# EAGLE design pc (EAGLE 7.1.0)
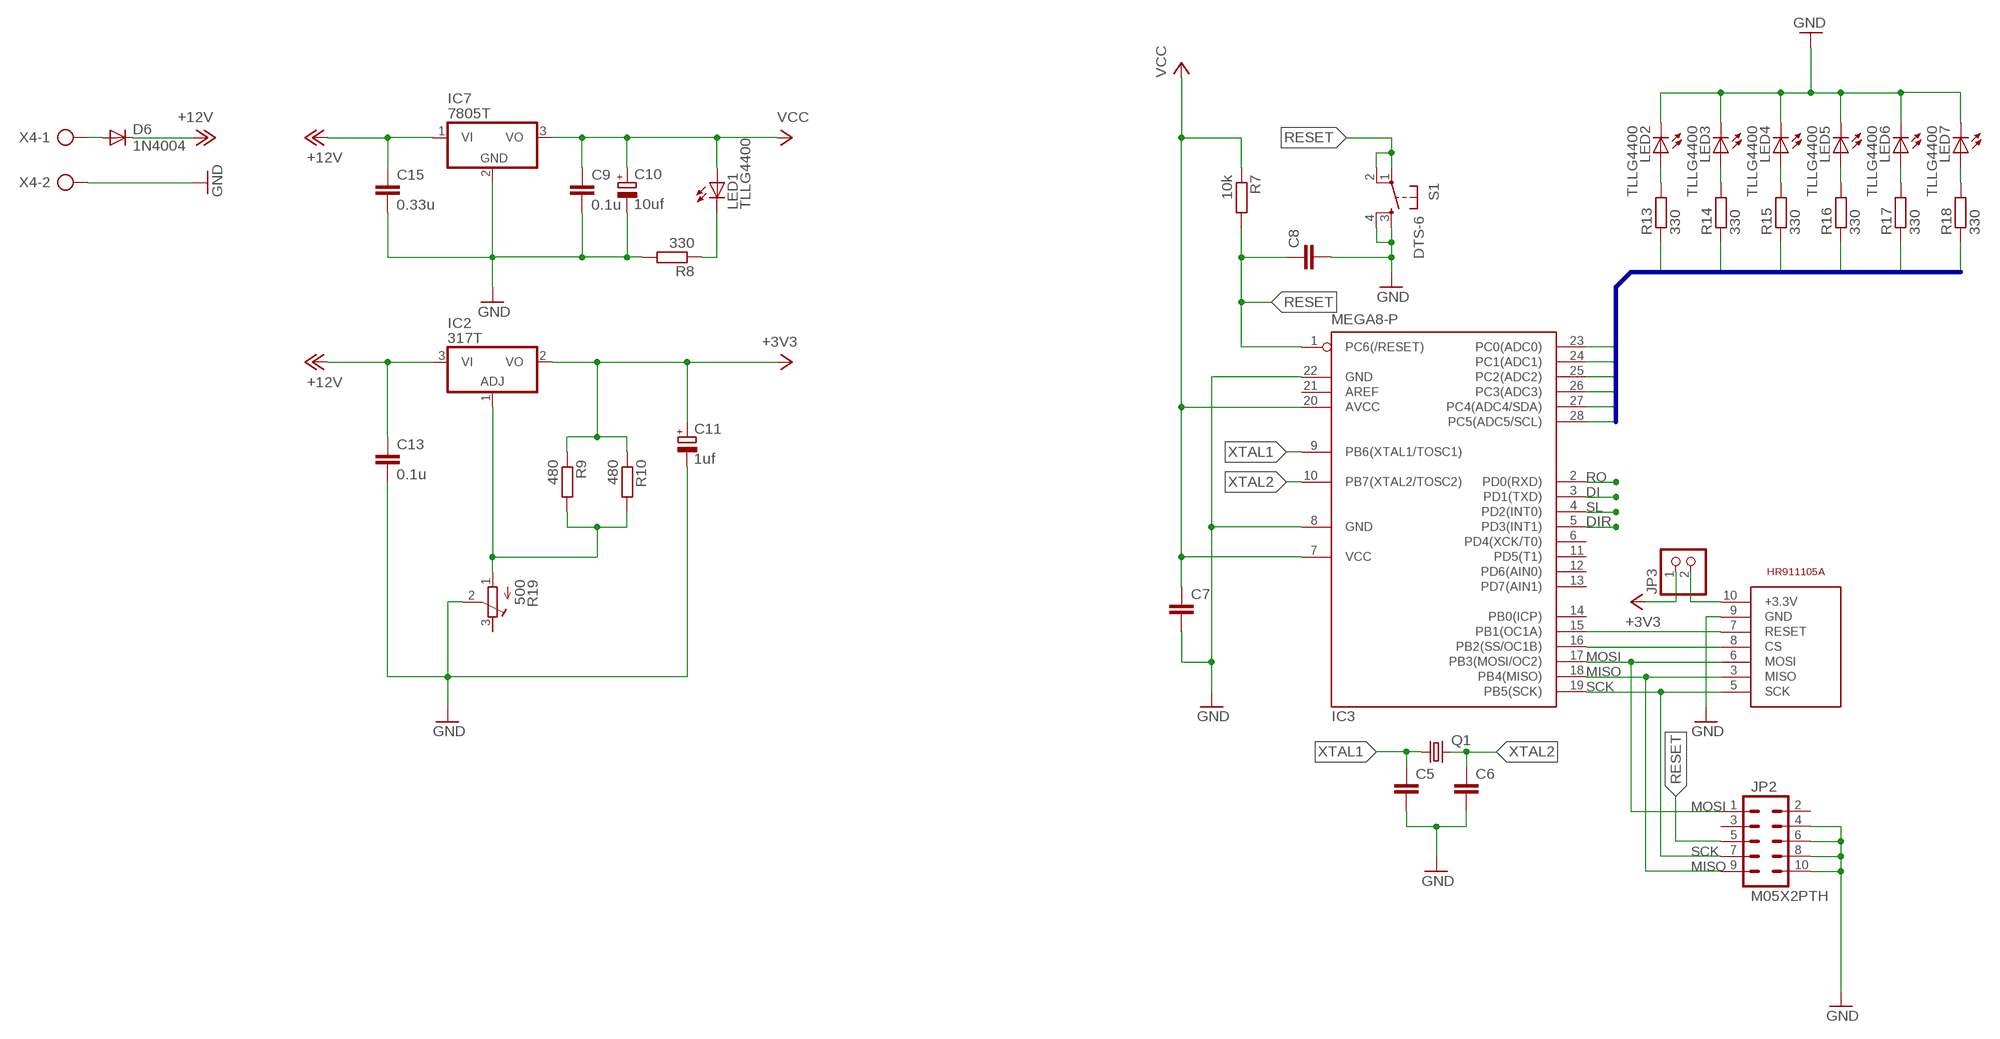
[diagram p0: schematic, sheet 1, part 1 of 2]
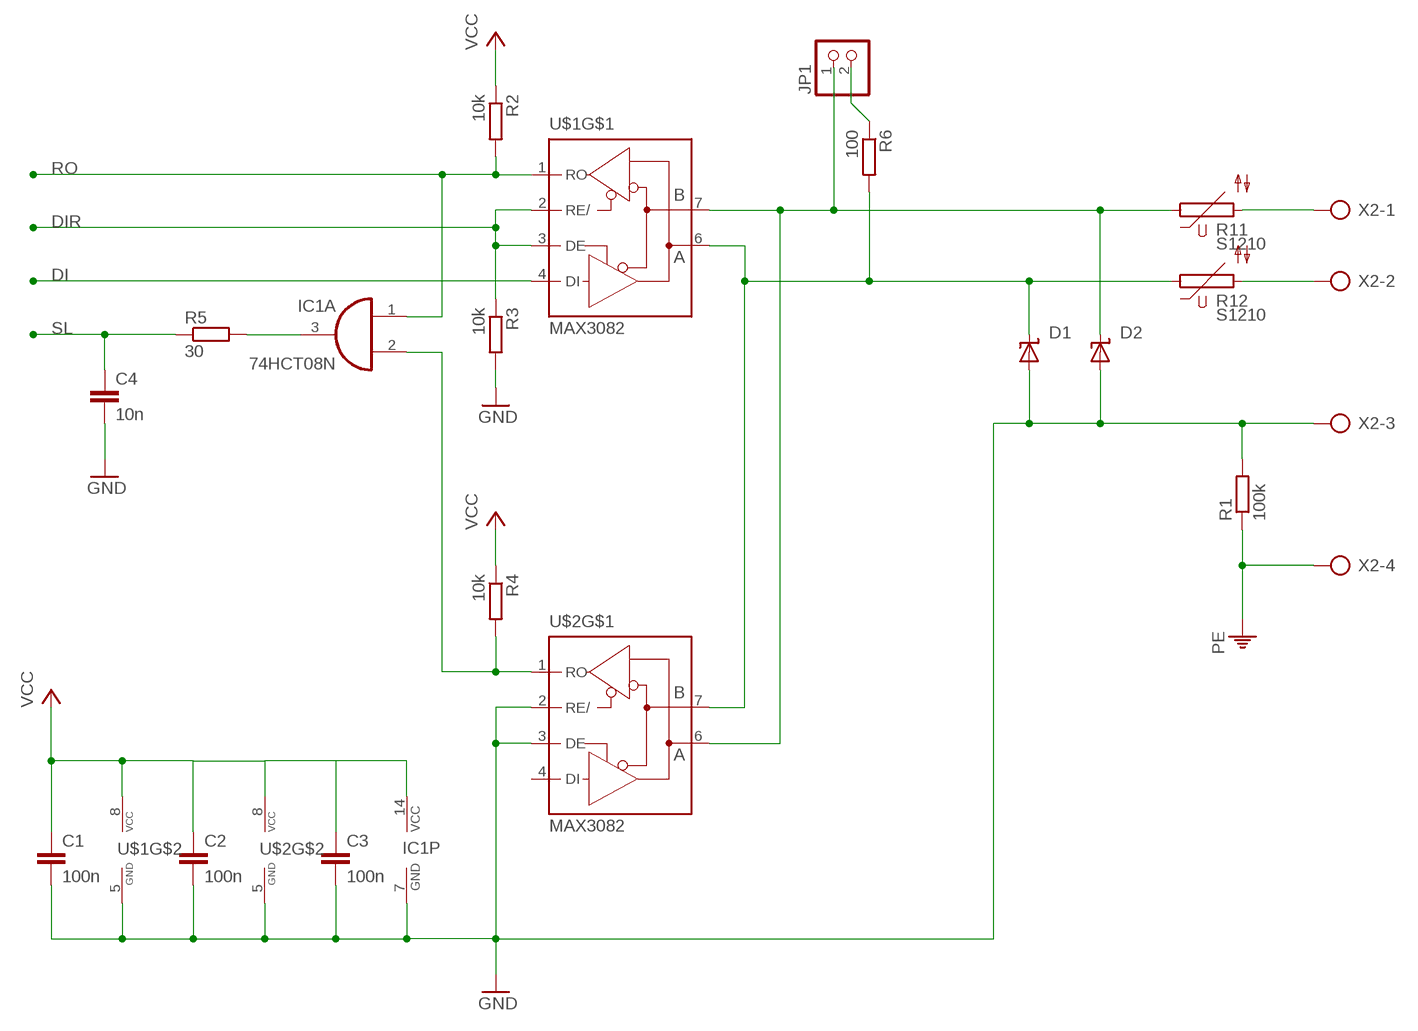
[diagram p1: schematic, sheet 1, part 2 of 2]

## Parts
C1  100n  C-EU050-035X075  [C050-035X075]
C2  100n  C-EU050-035X075  [C050-035X075]
C3  100n  C-EU050-035X075  [C050-035X075]
C4  10n  C-EU050-035X075  [C050-035X075]
C5  C-EU050-024X044  [C050-024X044]
C6  C-EU050-024X044  [C050-024X044]
C7  C-EU050-025X075  [C050-025X075]
C8  C-EU050-025X075  [C050-025X075]
C9  0.1u  C-EU025-024X044  [C025-024X044]
C10  10uf  CPOL-EUE2-4  [E2-4]
C11  1uf  CPOL-EUE2-4  [E2-4]
C13  0.1u  C-EU025-024X044  [C025-024X044]
C15  0.33u  C-EU025-024X044  [C025-024X044]
D1  SUPPRESSOR-SMBJ  [SMBJ]
D2  SUPPRESSOR-SMBJ  [SMBJ]
D6  1N4004  [DO41-10]
IC1  74HCT08N  [DIL14]
IC2  317T  [TO220H]
IC3  MEGA8-P  [DIL28-3]
IC7  7805T  [TO220H]
JP1  PINHD-1X2  [1X02]
JP2  M05X2PTH  [AVR_ICSP]
JP3  PINHD-1X2  [1X02]
LED1  TLLG4400  [LED3MM]
LED2  TLLG4400  [LED3MM]
LED3  TLLG4400  [LED3MM]
LED4  TLLG4400  [LED3MM]
LED5  TLLG4400  [LED3MM]
LED6  TLLG4400  [LED3MM]
LED7  TLLG4400  [LED3MM]
Q1  CRYSTALHC49U70  [HC49U70]
R1  100k  R-EU_0204/7  [0204/7]
R2  10k  R-EU_0204/7  [0204/7]
R3  10k  R-EU_0204/7  [0204/7]
R4  10k  R-EU_0204/7  [0204/7]
R5  30  R-EU_0207/10  [0207/10]
R6  100  R-EU_0204/7  [0204/7]
R7  10k  R-EU_0204/7  [0204/7]
R8  330  R-EU_0204/7  [0204/7]
R9  480  R-EU_0204/7  [0204/7]
R10  480  R-EU_0204/7  [0204/7]
R11  S1210  [S1210]
R12  S1210  [S1210]
R13  330  R-EU_0204/7  [0204/7]
R14  330  R-EU_0204/7  [0204/7]
R15  330  R-EU_0204/7  [0204/7]
R16  330  R-EU_0204/7  [0204/7]
R17  330  R-EU_0204/7  [0204/7]
R18  330  R-EU_0204/7  [0204/7]
R19  500  R-TRIMM64W  [RTRIM64W]
S1  DTS-6  [DTS-6]
U$1  MAX3082  [DIL08]
U$2  MAX3082  [DIL08]
U$3  HR911105A  [HR911105A]
X2  AK500/4  [AK500/4]
X4  AK500/2-H  [AK500/2-H]

## Nets
+3V3: C11.+ IC2.2(VO) JP3.1 R9.1 R10.1
+12V: C13.1 C15.1 D6.C IC2.3(VI) IC7.1(VI)
DI: IC3.3(PD1(TXD)) U$1.4(DI)
DIR: IC3.5(PD3(INT1)) R3.1 U$1.2(RE/) U$1.3(DE)
GND: C1.2 C2.2 C3.2 C4.2 C5.2 C6.2 C7.2 C8.2 C9.2 C10.- C11.- C13.2 C15.2 D1.A D2.A IC1.7(P:GND) IC3.8(GND) IC3.22(GND) IC7.2(GND) JP2.4 JP2.6 JP2.8 JP2.10 LED2.K(C) LED3.K(C) LED4.K(C) LED5.K(C) LED6.K(C) LED7.K(C) R1.2 R3.2 R8.2 R19.2(S) S1.3 S1.4 U$1.5(GND) U$2.2(RE/) U$2.3(DE) U$2.5(GND) U$3.9(GND) X2.3 X4.2
LED0: IC3.23(PC0(ADC0)) R13.1
LED1: IC3.24(PC1(ADC1)) R14.1
LED2: IC3.25(PC2(ADC2)) R15.1
LED3: IC3.26(PC3(ADC3)) R16.1
LED4: IC3.27(PC4(ADC4/SDA)) R17.1
LED5: IC3.28(PC5(ADC5/SCL)) R18.1
MISO: IC3.18(PB4(MISO)) JP2.9 U$3.3(MISO)
MOSI: IC3.17(PB3(MOSI/OC2)) JP2.1 U$3.6(MOSI)
N$1: IC2.1(ADJ) R9.2 R10.2 R19.1(A)
N$2: D1.C R6.2 R12.1 U$1.6(A) U$2.7(B)
N$3: IC1.2(A:I1) R4.2 U$2.1(RO)
N$4: LED1.K(C) R8.1
N$5: IC3.16(PB2(SS/OC1B)) U$3.8(CS)
N$6: LED2.A R13.2
N$7: IC1.3(A:O) R5.2
N$8: JP1.2 R6.1
N$9: R11.2 X2.1
N$10: D2.C JP1.1 R11.1 U$1.7(B) U$2.6(A)
N$11: R12.2 X2.2
N$12: LED3.A R14.2
N$13: LED4.A R15.2
N$14: LED5.A R16.2
N$15: LED6.A R17.2
N$16: LED7.A R18.2
N$17: IC3.15(PB1(OC1A)) U$3.7(RESET)
N$18: JP3.2 U$3.10(+3.3V)
N$19: D6.A X4.1
PE: R1.1 X2.4
RESET: C8.1 IC3.1(PC6(/RESET)) JP2.5 R7.2 S1.1 S1.2
RO: IC1.1(A:I0) IC3.2(PD0(RXD)) R2.2 U$1.1(RO)
SCK: IC3.19(PB5(SCK)) JP2.7 U$3.5(SCK)
SL: C4.1 IC3.4(PD2(INT0)) R5.1
VCC: C1.1 C2.1 C3.1 C7.1 C9.1 C10.+ IC1.14(P:VCC) IC3.7(VCC) IC3.20(AVCC) IC7.3(VO) LED1.A R2.1 R4.1 R7.1 U$1.8(VCC) U$2.8(VCC)
XTAL1: C5.1 IC3.9(PB6(XTAL1/TOSC1)) Q1.1
XTAL2: C6.1 IC3.10(PB7(XTAL2/TOSC2)) Q1.2
Unconnected: IC1.4(B:I0) IC1.5(B:I1) IC1.6(B:O) IC1.8(C:O) IC1.9(C:I0) IC1.10(C:I1) IC1.11(D:O) IC1.12(D:I0) IC1.13(D:I1) IC3.6(PD4(XCK/T0)) IC3.11(PD5(T1)) IC3.12(PD6(AIN0)) IC3.13(PD7(AIN1)) IC3.14(PB0(ICP)) IC3.21(AREF) JP2.2 JP2.3 R19.3(E) U$2.4(DI)

## Buses
LED[0..5]

## Library data of the parts
C1-C9 C13 C15 = rcl:C-EU: CAPACITOR, European symbol
C10 C11 = rcl:CPOL-EU: POLARIZED CAPACITOR, European symbol
D1 D2 = diode:SUPPRESSOR-: Suppressor diode
D6 = diode:1N4004: DIODE general purpose rectifier, 1 A
IC1 = 74xx-eu:74*08: Quad 2-input AND gate
IC2 = linear:*317: Positive VOLTAGE REGULATOR
IC3 = atmel:MEGA8-P: MICROCONTROLLER 8 Kbytes FLASH, 1 kbytes SRAM, 512 bytes EEPROM, USART, 4-channel 10 bit ADC, 2-channel 8 bit ADC Pin compatible with Atmega48, ATMega88, ATMega168 Source: avr.lbr; OC_FARNELL: unknown; OC_NEWARK: unknown
IC7 = linear:78*: Positive VOLTAGE REGULATOR Source: http://cache.national.com/ds/LM/LM78L05.pdf http://www.fairchildsemi.com/ds/LM/LM7805.pdf
JP1 JP3 = pinhead:PINHD-1X2: PIN HEADER
JP2 = SparkFun:M05X2: Header 5x2 Standard 10-pin dual row 0.1" header. Commonly used with AVR-ISP. Use with Spark Fun Electronics SKU: PRT-00778
LED1-LED7 = led:TLLG4400: Low Current (2mA) LED 3 mm Tinted Diffused Package color GREEN Source: Data sheet <http://www.farnell.com/datasheets/391098.pdf>; MF: VISHAY SEMICONDUCTOR; OC_FARNELL: 1612435
Q1 = crystal:CRYSTAL: CRYSTAL; OC_FARNELL: unknown; OC_NEWARK: unknown
R1-R4 R6 = resistor:R-EU_: RESISTOR, European symbol
R5 R7-R10 R13-R18 = rcl:R-EU_: RESISTOR, European symbol
R11 R12 = varistor:S1210: VARISTOR
R19 = rcl:R-TRIMM: Trimm resistor
S1 = switch-tact:DTS-6
U$1 U$2 = maxim:MAX3082
U$3 = ethernet:HR911105A
X2 = con-ptr500:AK500/4: CONNECTOR; OC_FARNELL: unknown; OC_NEWARK: unknown
X4 = con-ptr500:AK500/2-H: CONNECTOR Aug. 2004 / PTR Meßtechnik: Die Bezeichnung der Serie AK505 wurde geändert. Es handelt sich hierbei um AK500 in horizontaler Ausführung.; OC_FARNELL: unknown; OC_NEWARK: unknown

## Board
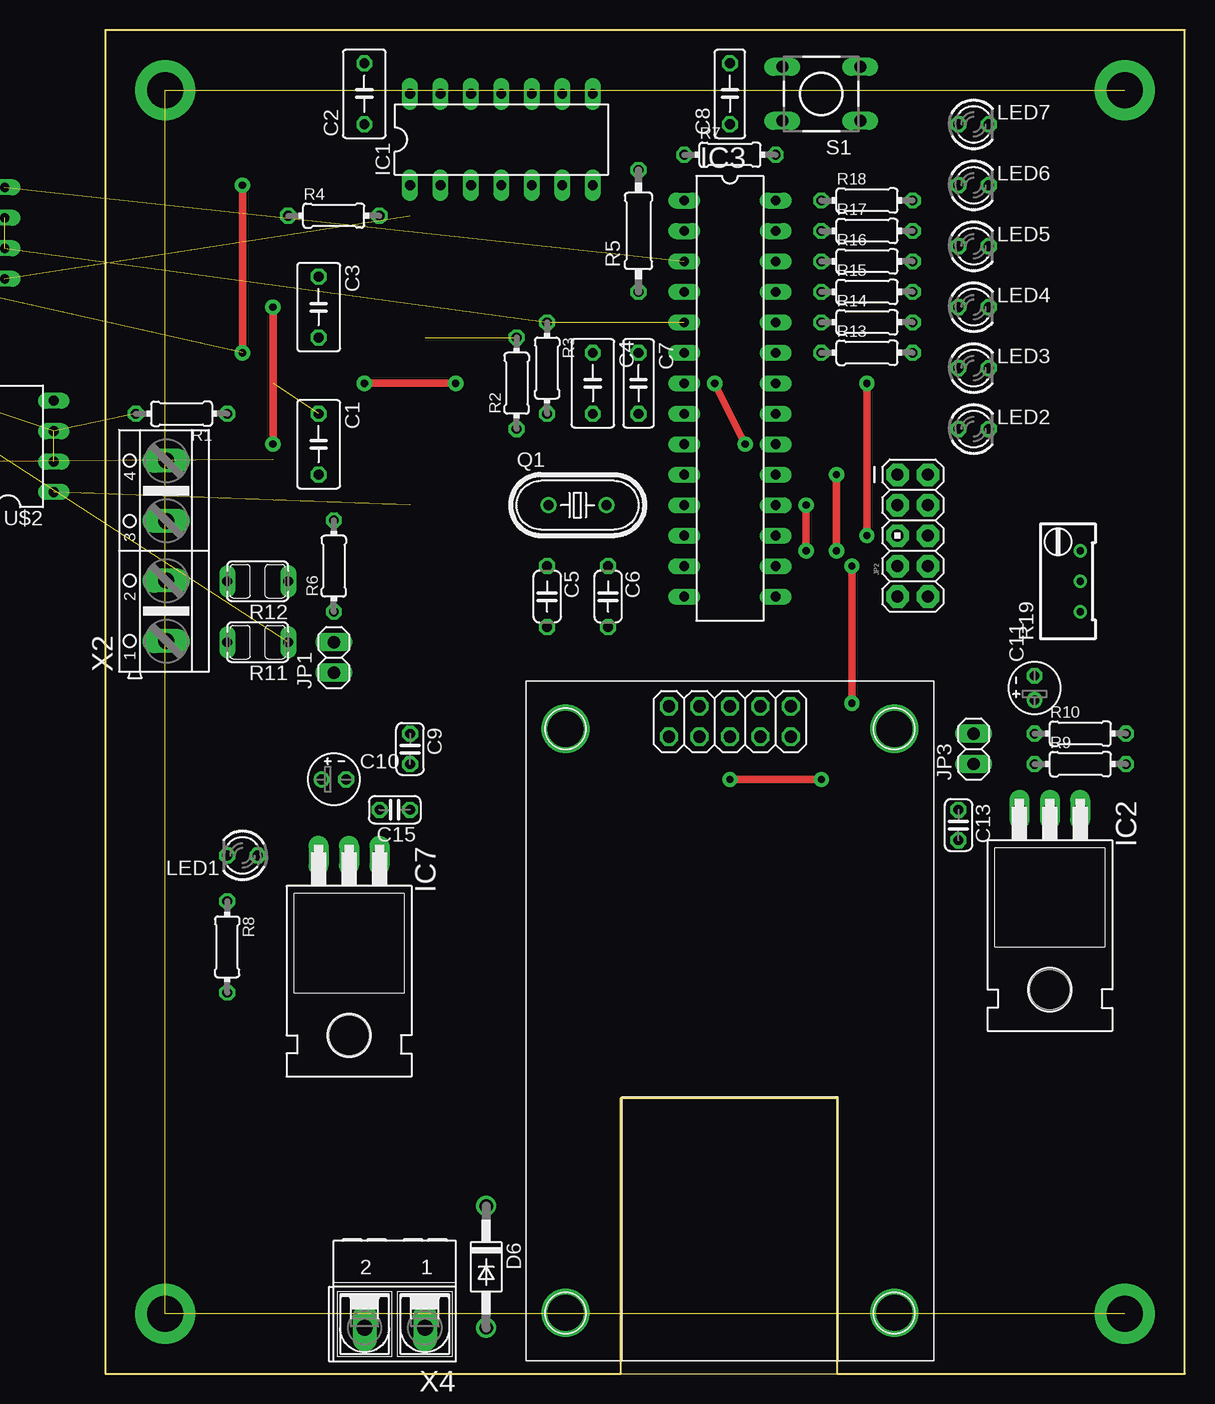
[diagram p2: board, top side]
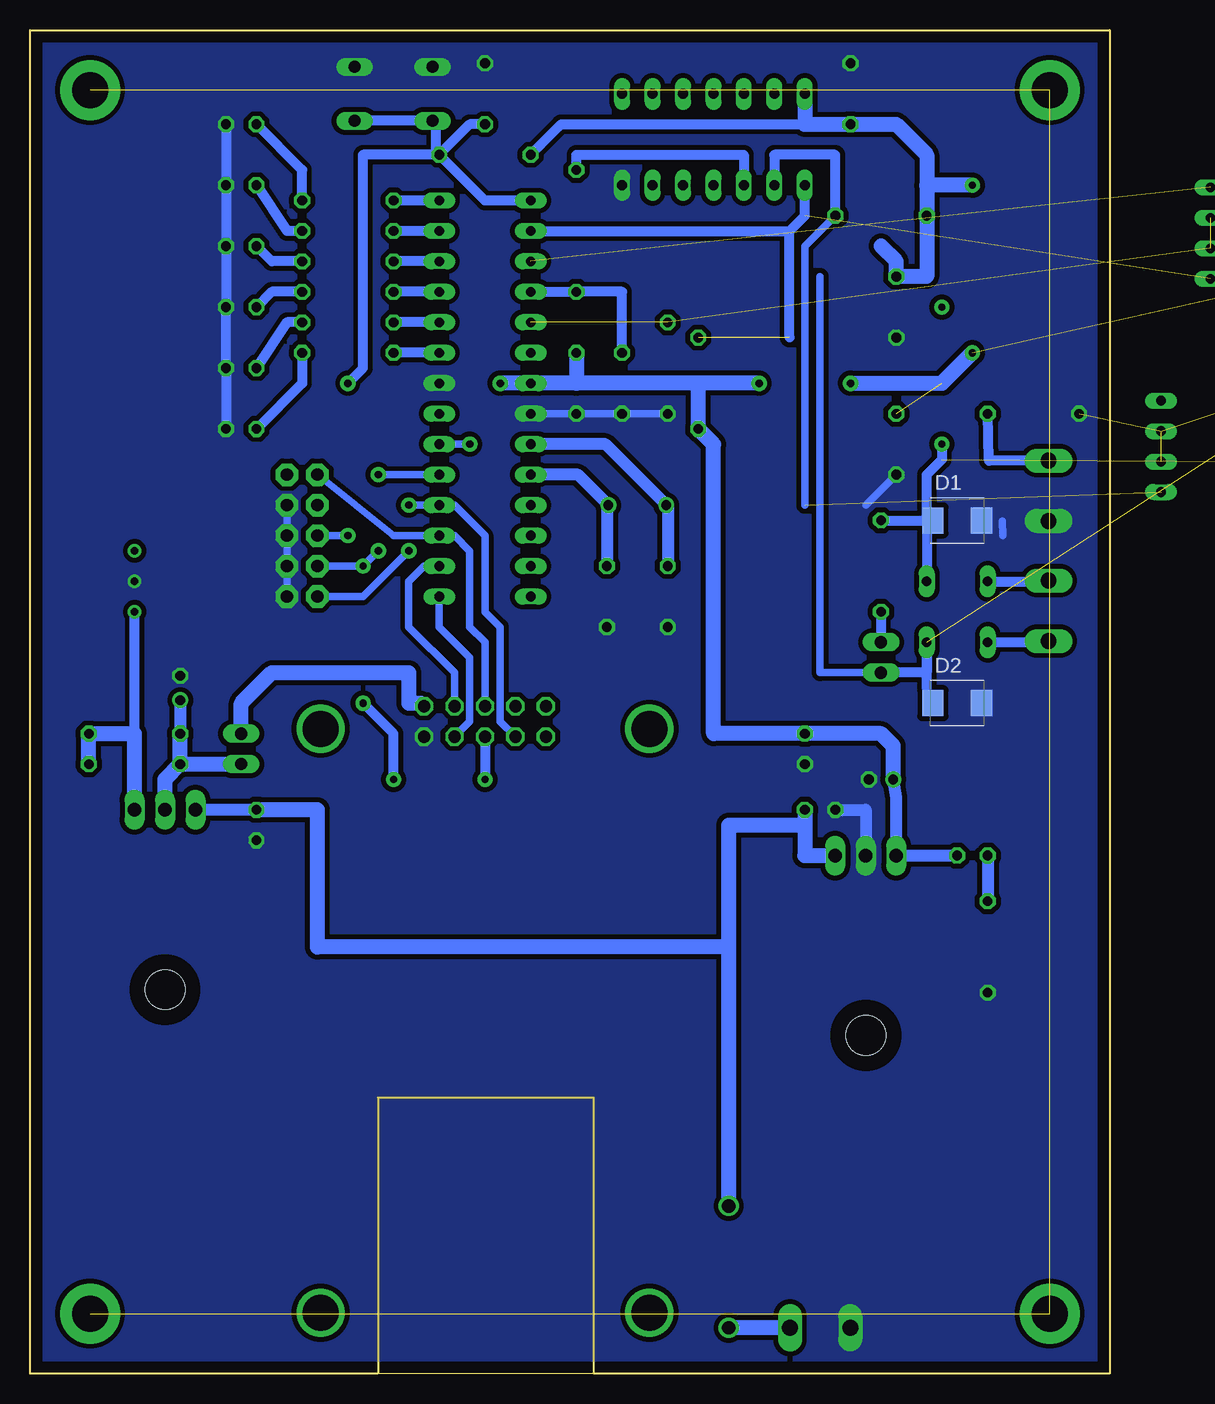
[diagram p3: board, bottom side, seen from below]

Size 90 x 112 mm. Coordinates in mm from the lower left corner, seen from the top.
Outline: 0,0 90,0 90,112 0,112 0,0
Copper layers (1*16): Top 0.035mm / dielectric 1.5mm / Bottom 0.035mm
Design rules "default": minimum track width 10mil, minimum drill 24mil, track to track 8mil, track to pad 8mil, pad to pad 8mil, via to via 8mil, smd to smd 8mil, copper to edge 40mil, drill to drill 8mil, minimum pad ring 10mil, minimum via ring 8mil, stop-mask expansion 4mil, vias tented up to drill 0mil, thermal gap 10mil
Milling: 8 lines

### Footprints (pad centres in the part's own frame; a part is rotated, then mirrored left to right if it is on the bottom)
C050-035X075 = drill 0.813 octagon: 1 -2.54,0; 2 2.54,0
C050-024X044 = drill 0.813 octagon: 1 -2.54,0; 2 2.54,0
C050-025X075 = drill 0.813 octagon: 1 -2.54,0; 2 2.54,0
C025-024X044 = drill 0.813 octagon: 1 -1.27,0; 2 1.27,0
E2-4 = drill 0.813 pad 1.27: + -1.016,0 | drill 0.813 pad 1.27 octagon: - 1.016,0
SMBJ = smd 1.78 x 2.16: A 2.04,0; C -2.03,0
DO41-10 = drill 1.118: A 5.08,0; C -5.08,0
DIL14 = drill 0.813 long: 1 -7.62,-3.81; 2 -5.08,-3.81; 3 -2.54,-3.81; 4 0,-3.81; 5 2.54,-3.81; 6 5.08,-3.81; 7 7.62,-3.81; 8 7.62,3.81; 9 5.08,3.81; 10 2.54,3.81; 11 0,3.81; 12 -2.54,3.81; 13 -5.08,3.81; 14 -7.62,3.81
TO220H = drill 1.118 long: 1 -2.54,-10.16; 2 0,-10.16; 3 2.54,-10.16 | hole 3.302: 0,4.826
DIL28-3 = drill 0.813 long: 1 -16.51,-3.81; 2 -13.97,-3.81; 3 -11.43,-3.81; 4 -8.89,-3.81; 5 -6.35,-3.81; 6 -3.81,-3.81; 7 -1.27,-3.81; 8 1.27,-3.81; 9 3.81,-3.81; 10 6.35,-3.81; 11 8.89,-3.81; 12 11.43,-3.81; 13 13.97,-3.81; 14 16.51,-3.81; 15 16.51,3.81; 16 13.97,3.81; 17 11.43,3.81; 18 8.89,3.81; 19 6.35,3.81; 20 3.81,3.81; 21 1.27,3.81; 22 -1.27,3.81; 23 -3.81,3.81; 24 -6.35,3.81; 25 -8.89,3.81; 26 -11.43,3.81; 27 -13.97,3.81; 28 -16.51,3.81
1X02 = drill 1.016 long: 1 -1.27,0; 2 1.27,0
AVR_ICSP = drill 1.016 pad 1.88 octagon: 1 -1.27,5.08; 2 1.27,5.08; 3 -1.27,2.54; 4 1.27,2.54; 5 -1.27,0; 6 1.27,0; 7 -1.27,-2.54; 8 1.27,-2.54; 9 -1.27,-5.08; 10 1.27,-5.08
LED3MM = drill 0.813 octagon: A -1.27,0; K 1.27,0
HC49U70 = drill 0.813: 1 -2.413,0; 2 2.413,0
0204/7 = drill 0.813 octagon: 1 -3.81,0; 2 3.81,0
0207/10 = drill 0.813 octagon: 1 -5.08,0; 2 5.08,0
S1210 = drill 0.813 long: 1 -2.54,0; 2 2.54,0
RTRIM64W = drill 0.61: 1 1.27,-2.54; 2 1.27,0; 3 1.27,2.54
DTS-6 = drill 1 long: 1 -3.25,2.25; 2 3.25,2.25; 3 -3.25,-2.25; 4 3.25,-2.25
DIL08 = drill 0.813 long: 1 -3.81,-3.81; 2 -1.27,-3.81; 3 1.27,-3.81; 4 3.81,-3.81; 5 3.81,3.81; 6 1.27,3.81; 7 -1.27,3.81; 8 -3.81,3.81
HR911105A = drill 1.016 octagon: 1 -21.34,-5.08; 2 -23.88,-5.08; 3 -21.34,-2.54; 4 -23.88,-2.54; 5 -21.34,0; 6 -23.88,0; 7 -21.34,2.54; 8 -23.88,2.54; 9 -21.34,5.08; 10 -23.88,5.08 | drill 3 pad 4: P$1 -22,13.7; P$2 26.7,13.7; P$3 -22,-13.7; P$4 26.7,-13.7
AK500/4 = drill 1.321 long: 1 -7.518,0; 2 -2.489,0; 3 2.489,0; 4 7.518,0
AK500/2-H = drill 1.321 long: 1 -2.515,0; 2 2.515,0

### Placement (x,y rotation side)
C1  17.78,77.47 270 top
C2  21.59,106.68 90 top
C3  17.78,88.9 270 top
C4  40.64,82.55 270 top
C5  36.83,64.77 270 top
C6  41.91,64.77 270 top
C7  44.45,82.55 270 top
C8  52.07,106.68 90 top
C9  25.4,52.07 270 top
C10  19.05,49.53 0 top
C11  77.47,57.15 90 top
C13  71.12,45.72 270 top
C15  24.13,46.99 180 top
D1  12.7,71.12 0 bottom
D2  12.7,55.88 0 bottom
D6  31.75,8.89 270 top
IC1  33.02,102.87 0 top
IC2  78.74,36.83 180 top
IC3  52.07,81.28 270 top
IC7  20.32,33.02 180 top
JP1  19.05,59.69 90 top
JP2  67.31,69.85 0 top
JP3  72.39,52.07 90 top
LED1  11.43,43.18 180 top
LED2  72.39,78.74 0 top
LED3  72.39,83.82 0 top
LED4  72.39,88.9 0 top
LED5  72.39,93.98 0 top
LED6  72.39,99.06 0 top
LED7  72.39,104.14 0 top
Q1  39.37,72.39 0 top
R1  6.35,80.01 180 top
R2  34.29,82.55 90 top
R3  36.83,83.82 270 top
R4  19.05,96.52 0 top
R5  44.45,95.25 90 top
R6  19.05,67.31 90 top
R7  52.07,101.6 0 top
R8  10.16,35.56 270 top
R9  81.28,50.8 0 top
R10  81.28,53.34 0 top
R11  12.7,60.96 180 top
R12  12.7,66.04 180 top
R13  63.5,85.09 0 top
R14  63.5,87.63 0 top
R15  63.5,90.17 0 top
R16  63.5,92.71 0 top
R17  63.5,95.25 0 top
R18  63.5,97.79 0 top
R19  80.01,66.04 0 top
S1  59.69,106.68 180 top
U$1  -12.22,95.07 90 top  (outside the outline)
U$2  -8.11,77.29 90 top  (outside the outline)
U$3  52.07,31.75 270 top
X2  5.08,68.58 90 top
X4  24.13,3.81 180 top

### Tracks (layer width: path | path; a pad name or v marks a point on that pad's centre or on a via)
+3V3
  Bottom 1.016: C11.+ R10.1
  Bottom 1.27: IC2.2 78.74,49.53 R9.1 | R9.1 JP3.1 | R9.1 R10.1
+12V
  Bottom 1.016: C13.1 IC2.3
  Bottom 1.27: D6.C 31.75,35.56 | 31.75,35.56 31.75,45.72 25.4,45.72 | 25.4,45.72 25.4,43.18 IC7.1 | 31.75,35.56 66.04,35.56 66.04,46.99 C13.1 | C15.1 25.4,45.72
DI  (1 unrouted)
DIR  (3 unrouted)
GND  (4 unrouted)
  Bottom 0.61: JP2.10 JP2.8 JP2.6 JP2.4 | IC3.8 C7.2 C4.2 R3.2 | C1.2 20.32,72.39 | 8.94,71.07 8.89,69.85
  Bottom 0.813: LED7.K LED6.K LED5.K LED4.K LED3.K LED2.K
  Bottom 1.016: C15.2 20.32,46.99 IC7.2
  pour Bottom (isolate 0.406, no thermals): 0,0 90,0 90,112 0,112
LED0
  Bottom 0.813: IC3.23 R13.1
LED1
  Bottom 0.813: IC3.24 R14.1
LED2
  Bottom 0.813: IC3.25 R15.1
LED3
  Bottom 0.813: IC3.26 R16.1
LED4
  Bottom 0.813: IC3.27 R17.1
LED5
  Bottom 0.813: IC3.28 R18.1
MISO  (via drill 0.6 pad 1.27)
  Top 0.61: v58.42,68.58 v58.42,72.39
  Bottom 0.61: U$3.3 50.8,54.36 50.8,62.23 52.07,63.5 52.07,69.85 54.61,72.39 IC3.18 v58.42,72.39 | JP2.9 62.23,64.77 v58.42,68.58
MOSI
  Bottom 0.61: U$3.6 52.07,60.96 53.34,62.23 53.34,68.58 54.61,69.85 IC3.17 59.69,69.85 JP2.1
N$1
  Bottom 0.813: 81.28,53.34 R19.1
  Bottom 1.27: IC2.1 81.28,53.34 R10.2 R9.2
N$2  (via drill 0.6 pad 1.27)  (2 unrouted)
  Top 0.61: v13.97,88.9 v13.97,77.47
  Bottom 0.61: D1.C 15.24,71.12
  Bottom 0.813: v13.97,77.47 13.97,76.2 15.24,74.93 15.24,71.12 | R6.2 15.24,71.12 | 15.24,71.12 R12.1
N$3  (1 unrouted)
  Bottom 0.61: 25.4,72.39 25.4,93.98 R4.2
  Bottom 0.813: IC1.2 27.94,101.6 22.86,101.6 R4.2
N$4
  Bottom 1.016: LED1.K R8.1
N$5
  Bottom 0.61: IC3.16 57.15,67.31 58.42,66.04 58.42,62.23 54.61,58.42 U$3.8
N$6
  Bottom 0.813: R13.2 67.31,82.55 LED2.A
N$7
  Bottom 0.813: R5.2 44.45,101.6 30.48,101.6 IC1.3
N$8
  Bottom 0.813: R6.1 JP1.2
N$9
  Bottom 0.61: 5.18,60.96 X2.1
  Bottom 0.813: R11.2 5.18,60.96
N$10  (2 unrouted)
  Bottom 0.61: D2.C 15.24,57.15 | JP1.1 24.13,58.42 24.13,91.44
  Bottom 0.813: 15.24,57.15 R11.1 15.24,58.42 JP1.1
N$11
  Bottom 0.61: 5.13,66.04 X2.2
  Bottom 0.813: R12.2 5.13,66.04
N$12
  Bottom 0.813: R14.2 68.58,87.63 LED3.A
N$13
  Bottom 0.813: R15.2 69.85,90.17 LED4.A
N$14
  Bottom 0.813: R16.2 69.85,92.71 LED5.A
N$15
  Bottom 0.813: R17.2 68.58,95.25 LED6.A
N$16
  Bottom 0.813: R18.2 67.31,100.33 LED7.A
N$17
  Bottom 0.61: IC3.15 55.88,62.23 53.34,59.69 53.34,54.36 U$3.7
N$18
  Bottom 1.27: JP3.2 72.39,55.88 69.85,58.42 58.42,58.42 58.42,55.88 57.4,55.88 U$3.10
N$19
  Bottom 1.27: X4.1 D6.A
N$22  (via drill 3 pad 5)  (3 unrouted)
  other vias: 5,5 85,5 5,107 85,107
PE
  Bottom 0.813: X2.4 10.06,76.1 R1.1
RESET  (via drill 0.6 pad 1.27)
  Top 0.61: v63.5,69.85 v63.5,82.55
  Bottom 0.61: JP2.5 v63.5,69.85 | S1.2 58.71,104.43 | R7.2 56.15,101.6
  Bottom 0.813: v63.5,82.55 62.23,83.82 62.23,101.6 56.15,101.6 56.15,104.14 S1.2 S1.1 | IC3.1 52.07,97.79 R7.2 53.34,104.14 C8.1
RO  (2 unrouted)
  Bottom 0.813: 26.67,86.36 26.67,95.25 | IC3.2 26.67,95.25 | 26.67,95.25 25.4,96.52 IC1.1
SCK  (via drill 0.6 pad 1.27)
  Top 0.61: v60.96,68.58 v60.96,74.93 | v62.23,55.88 v62.23,67.31 | v52.07,49.53 v59.69,49.53
  Bottom 0.61: JP2.7 v62.23,67.31 v60.96,68.58 | v60.96,74.93 IC3.19
  Bottom 0.813: U$3.5 v52.07,49.53 | v59.69,49.53 59.69,53.34 v62.23,55.88
SL
  Bottom 0.813: IC3.4 R5.1 40.64,90.17 C4.1
VCC  (via drill 0.6 pad 1.27)  (3 unrouted)
  Top 0.61: v50.8,82.55 v53.34,77.47 | v21.59,82.55 v29.21,82.55 | v11.43,85.09 v11.43,99.06
  Bottom 0.61: IC3.20 v53.34,77.47
  Bottom 0.813: R7.1 45.72,104.14 25.4,104.14
  Bottom 1.016: C10.+ 17.78,48.01 IC7.3 LED1.A
  Bottom 1.27: 19.05,93.98 17.78,92.71 C3.1 15.24,91.44 R4.1 15.24,99.06 | IC1.14 25.4,104.14 C2.1 17.78,104.14 15.24,101.6 15.24,99.06 | C10.+ 18.03,52.32 19.05,53.34 C9.1 33.02,53.34 33.02,77.47 R2.1 34.29,82.55 | 34.29,82.55 44.45,82.55 | 44.45,82.55 IC3.7 v50.8,82.55 | C7.1 44.45,82.55 | v29.21,82.55 34.29,82.55 | v21.59,82.55 13.97,82.55 v11.43,85.09 | v11.43,99.06 15.24,99.06
XTAL1
  Bottom 1.016: IC3.9 42.04,77.47 Q1.1 36.83,72.26 C5.1
XTAL2
  Bottom 1.016: IC3.10 44.32,74.93 Q1.2 41.91,72.26 C6.1